# Altium schematic sheet MCU_CTRL.SchDoc: Y1701
size A3; Date: 2018.11.13; Author: Xianrui; CompanyName: 成都捷祥医疗器械有限公司; Revision: V1.0; SheetNumber: 2; SheetTotal: 6
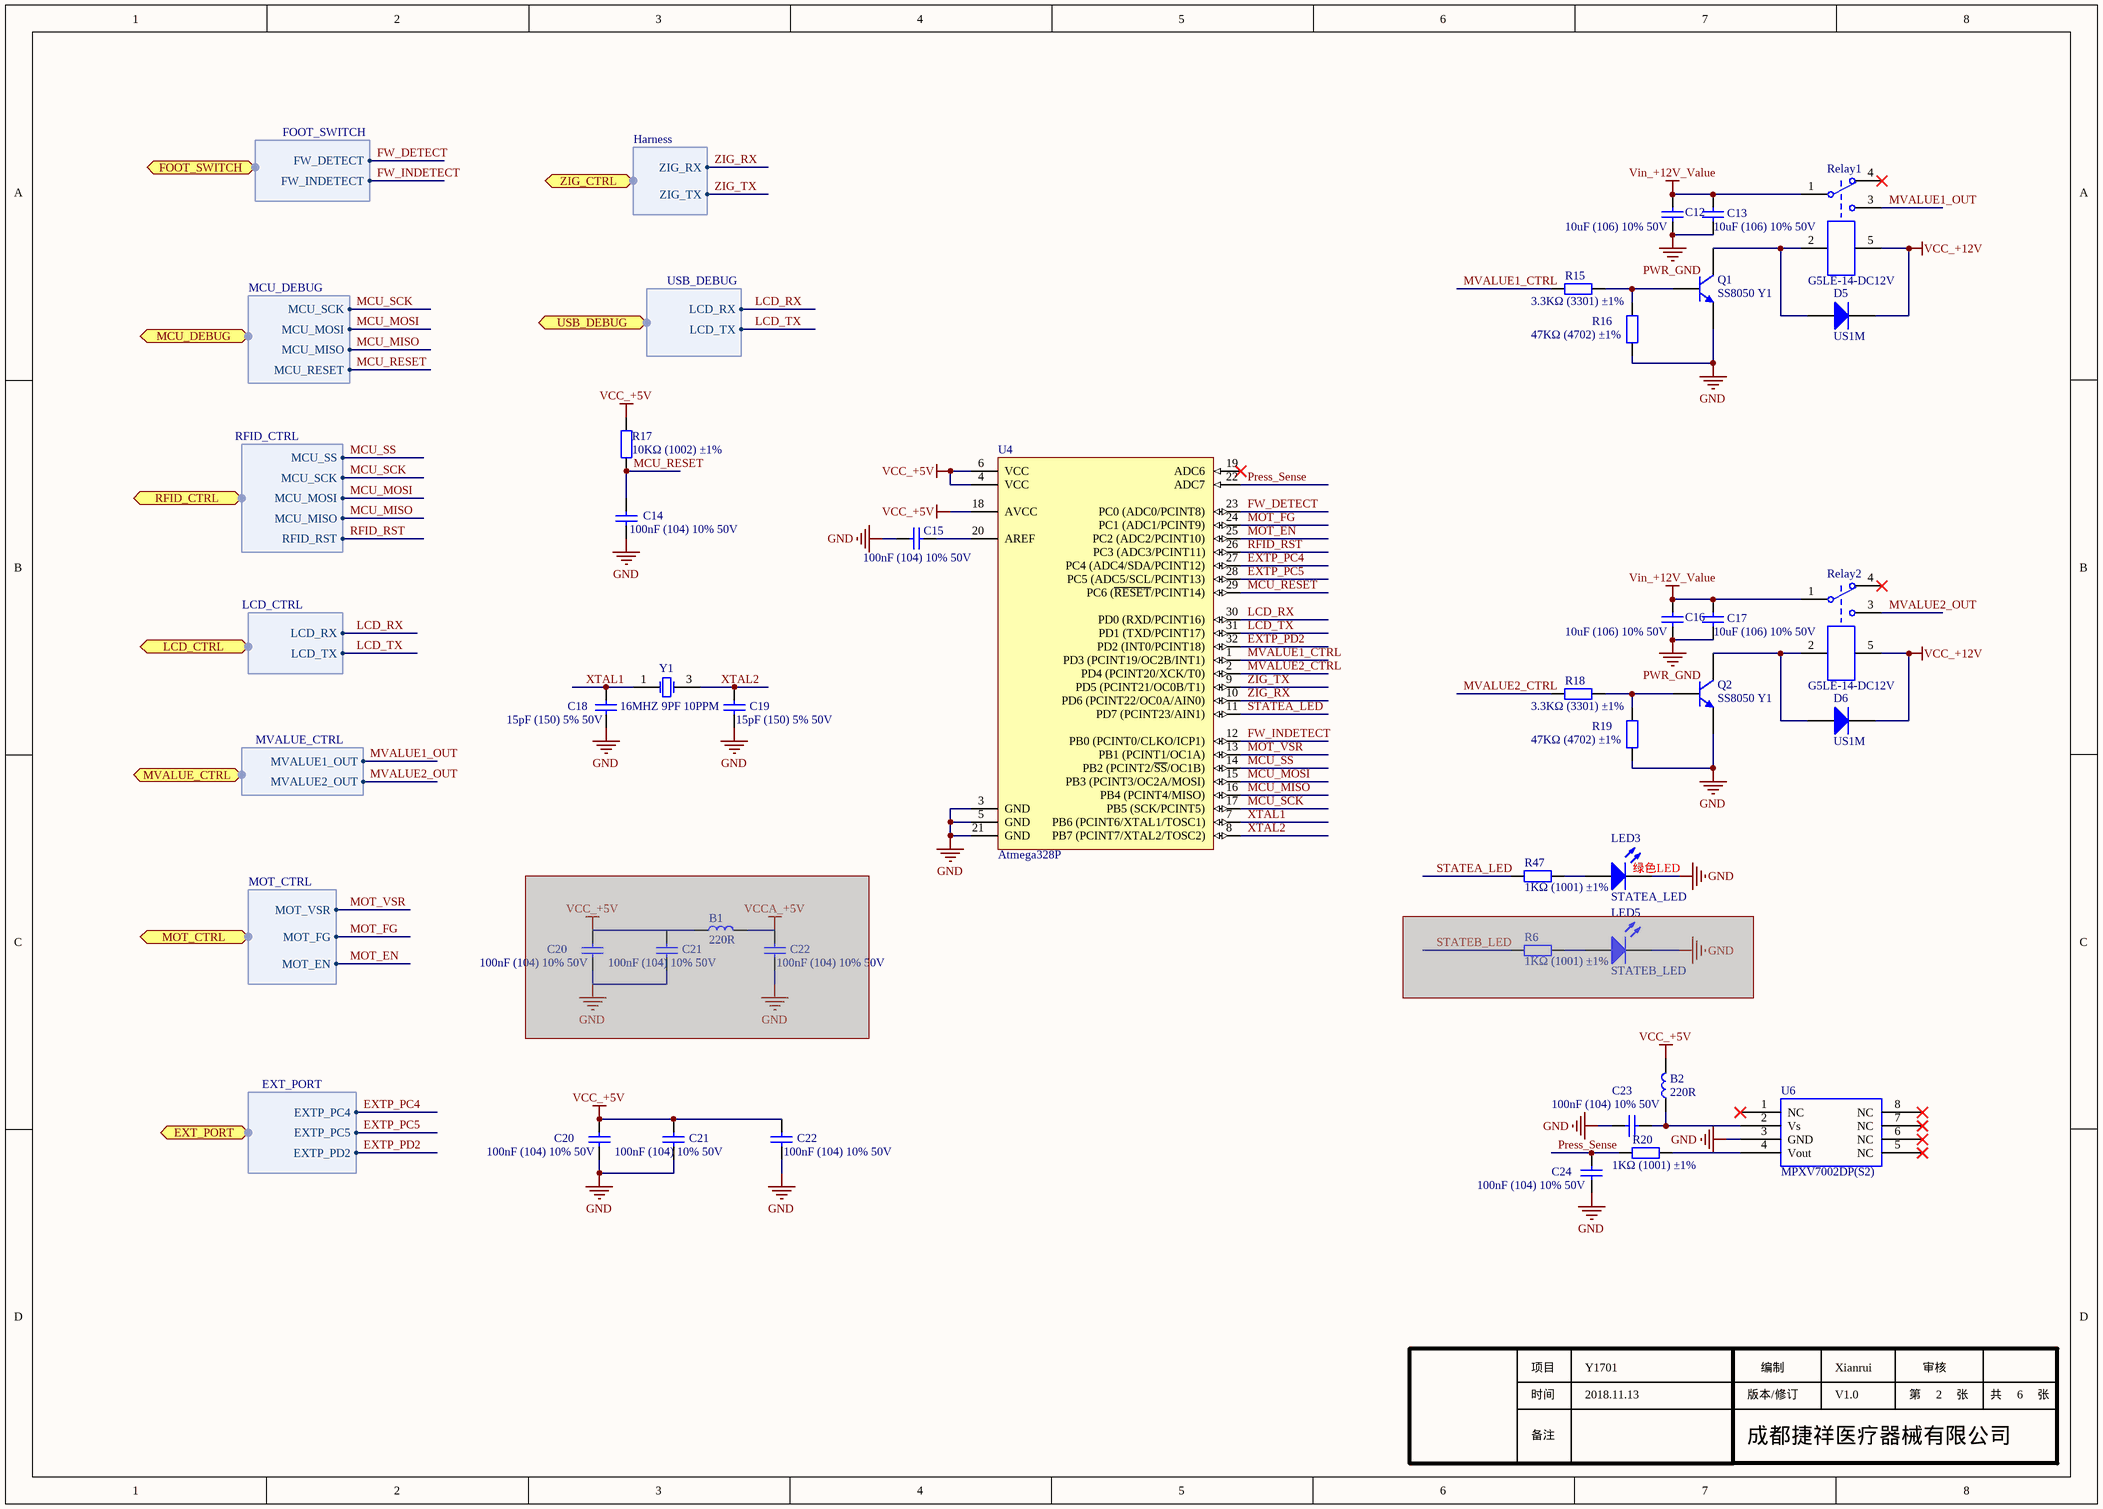
[diagram p0: MCU_CTRL.SchDoc]

## Parts
(Parts that share a designator on the sheet are numbered #1, #2 ... from top to bottom, then left to right.)
B1  220R  [LC-0805_L]  (masked out: inside a compile mask, not in the netlist)
B2  220R  [LC-0805_L]
C12  10uF (106) 10% 50V  [LC-1206_C]
C13  10uF (106) 10% 50V  [LC-1206_C]
C14  100nF (104) 10% 50V  [LC-0603_C]
C15  100nF (104) 10% 50V  [LC-0603_C]
C16  10uF (106) 10% 50V  [LC-1206_C]
C17  10uF (106) 10% 50V  [LC-1206_C]
C18  15pF (150) 5% 50V  [LC-0603_C]
C19  15pF (150) 5% 50V  [LC-0603_C]
C20#1  100nF (104) 10% 50V  [LC-0603_C]  (masked out: inside a compile mask, not in the netlist)
C20#2  100nF (104) 10% 50V  [LC-0603_C]
C21#1  100nF (104) 10% 50V  [LC-0603_C]  (masked out: inside a compile mask, not in the netlist)
C21#2  100nF (104) 10% 50V  [LC-0603_C]
C22#1  100nF (104) 10% 50V  [LC-0603_C]  (masked out: inside a compile mask, not in the netlist)
C22#2  100nF (104) 10% 50V  [LC-0603_C]
C23  100nF (104) 10% 50V  [LC-0603_C]
C24  100nF (104) 10% 50V  [LC-0603_C]
D5  US1M  [LC-SMA(DO-214AC)_S1]
D6  US1M  [LC-SMA(DO-214AC)_S1]
LED3  STATEA_LED  [LC-0603_LED_S1]
LED5  STATEB_LED  [LC-0603_LED_S1]  (masked out: inside a compile mask, not in the netlist)
Q1  SS8050 Y1  [LC-SOT-23(SOT-23-3)]
Q2  SS8050 Y1  [LC-SOT-23(SOT-23-3)]
R6  1KΩ (1001) ±1%  [LC-0603_R]  (masked out: inside a compile mask, not in the netlist)
R15  3.3KΩ (3301) ±1%  [LC-0603_R]
R16  47KΩ (4702) ±1%  [LC-0603_R]
R17  10KΩ (1002) ±1%  [LC-0603_R]
R18  3.3KΩ (3301) ±1%  [LC-0603_R]
R19  47KΩ (4702) ±1%  [LC-0603_R]
R20  1KΩ (1001) ±1%  [LC-0603_R]
R47  1KΩ (1001) ±1%  [LC-0603_R]
Relay1  G5LE-14-DC12V  [RCRELAY-G5LE-14]
Relay2  G5LE-14-DC12V  [RCRELAY-G5LE-14]
U4  Atmega328P  [RCIC-TQFP-32]
U6  MPXV7002DP(S2)  [MPXV7002DP]
Y1  16MHZ 9PF 10PPM  [LC-SMD-3225_4P]

## Ports
EXT_PORT (harness EXT_PORT), FOOT_SWITCH (harness FOOT_SWITCH), LCD_CTRL (harness LCD_CTRL), MCU_DEBUG (harness MCU_DEBUG), MOT_CTRL (harness MOT_CTRL), MVALUE_CTRL (harness MVALUE_CTRL), RFID_CTRL (harness RFID_CTRL), USB_DEBUG (harness USB_DEBUG), ZIG_CTRL (harness Harness)

## Harnesses
RFID_CTRL: MCU_SS, MCU_SCK, MCU_MOSI, MCU_MISO, RFID_RST
MCU_DEBUG: MCU_SCK, MCU_MOSI, MCU_MISO, MCU_RESET
LCD_CTRL: LCD_RX, LCD_TX
MVALUE_CTRL: MVALUE1_OUT, MVALUE2_OUT
EXT_PORT: EXTP_PC4, EXTP_PC5, EXTP_PD2
Harness: ZIG_RX, ZIG_TX
FOOT_SWITCH: FW_DETECT, FW_INDETECT
USB_DEBUG: LCD_RX, LCD_TX
MOT_CTRL: MOT_VSR, MOT_FG, MOT_EN

## Nets
GND: C14.1 C15.1 C18.1 C19.1 C20#2.1 C21#2.1 C22#2.1 C23.2 C24.1 LED3.K Q1.2(E) Q2.2(E) R16.1 R19.1 U4.3(GND) U4.5(GND) U4.21(GND) U6.3(GND)
PWR_GND: C12.1 C13.1 C16.1 C17.1
VCC_+5V: B2.2 C20#2.2 C21#2.2 C22#2.2 R17.2 U4.4(VCC) U4.6(VCC) U4.18(AVCC)
VCC_+12V: D5.2(K) D6.2(K) Relay1.5 Relay2.5
Vin_+12V_Value: C12.2 C13.2 C16.2 C17.2 Relay1.1 Relay2.1
EXTP_PC4: U4.27(PC4_(ADC4/SDA/PCINT12)) ; port EXT_PORT.EXTP_PC4
EXTP_PC5: U4.28(PC5_(ADC5/SCL/PCINT13)) ; port EXT_PORT.EXTP_PC5
EXTP_PD2: U4.32(PD2_(INT0/PCINT18)) ; port EXT_PORT.EXTP_PD2
FW_DETECT: U4.23(PC0_(ADC0/PCINT8)) ; port FOOT_SWITCH.FW_DETECT
FW_INDETECT: U4.12(PB0_(PCINT0/CLKO/ICP1)) ; port FOOT_SWITCH.FW_INDETECT
LCD_RX: U4.30(PD0_(RXD/PCINT16)) ; port LCD_CTRL.LCD_RX, port USB_DEBUG.LCD_RX
LCD_TX: U4.31(PD1_(TXD/PCINT17)) ; port LCD_CTRL.LCD_TX, port USB_DEBUG.LCD_TX
MCU_MISO: U4.16(PB4_(PCINT4/MISO)) ; port RFID_CTRL.MCU_MISO, port MCU_DEBUG.MCU_MISO
MCU_MOSI: U4.15(PB3_(PCINT3/OC2A/MOSI)) ; port RFID_CTRL.MCU_MOSI, port MCU_DEBUG.MCU_MOSI
MCU_RESET: C14.2 R17.1 U4.29(PC6_(~{RESET}/PCINT14)) ; port MCU_DEBUG.MCU_RESET
MCU_SCK: U4.17(PB5_(SCK/PCINT5)) ; port RFID_CTRL.MCU_SCK, port MCU_DEBUG.MCU_SCK
MCU_SS: U4.14(PB2_(PCINT2/~{SS}/OC1B)) ; port RFID_CTRL.MCU_SS
MOT_EN: U4.25(PC2_(ADC2/PCINT10)) ; port MOT_CTRL.MOT_EN
MOT_FG: U4.24(PC1_(ADC1/PCINT9)) ; port MOT_CTRL.MOT_FG
MOT_VSR: U4.13(PB1_(PCINT1/OC1A)) ; port MOT_CTRL.MOT_VSR
MVALUE1_CTRL: R15.1 U4.1(PD3_(PCINT19/OC2B/INT1))
MVALUE1_OUT: Relay1.3 ; port MVALUE_CTRL.MVALUE1_OUT
MVALUE2_CTRL: R18.1 U4.2(PD4_(PCINT20/XCK/T0))
MVALUE2_OUT: Relay2.3 ; port MVALUE_CTRL.MVALUE2_OUT
Press_Sense: C24.2 R20.1 U4.22(ADC7)
RFID_RST: U4.26(PC3_(ADC3/PCINT11)) ; port RFID_CTRL.RFID_RST
STATEA_LED: R47.1 U4.11(PD7_(PCINT23/AIN1))
XTAL1: C18.2 U4.7(PB6_(PCINT6/XTAL1/TOSC1)) Y1.1(OSC1)
XTAL2: C19.2 U4.8(PB7_(PCINT7/XTAL2/TOSC2)) Y1.3(OSC2)
ZIG_RX: U4.10(PD6_(PCINT22/OC0A/AIN0)) ; port ZIG_CTRL.ZIG_RX
ZIG_TX: U4.9(PD5_(PCINT21/OC0B/T1)) ; port ZIG_CTRL.ZIG_TX
NetB2_1: B2.1 C23.1 U6.2(Vs)
NetC15_2: C15.2 U4.20(AREF)
NetD5_1: D5.1(A) Q1.3(C) Relay1.2
NetD6_1: D6.1(A) Q2.3(C) Relay2.2
NetLED3_A: LED3.A R47.2
NetQ1_1: Q1.1(B) R15.2 R16.2
NetQ2_1: Q2.1(B) R18.2 R19.2
NetR20_2: R20.2 U6.4(Vout)

Not connected (* = marked no-connect by the designer): Relay1 4*; Relay2 4*; U4 19(ADC6)*; U6 1(NC)* 5(NC)* 6(NC)* 7(NC)* 8(NC)*

## Notes on the sheet
- (near LED3) 绿色LED
- 项目
- 时间
- 版本/修订
- 编制
- 第
- 审核
- 张
- 共
- 备注

## Library data of the parts
B1 B2 = Bead: Bead,1400mA; Manufacture: muRata(村田); Ordering: BLM21PG221SN1; Comments: 220R; Libnum: *; LC: http://item.szlcsc.com/87016.html; LC Supplier Part Number: C85840
C12 C13 C16 C17 = 1206 10uF (106) 10% 50V: 贴片电容; ComponentLink1Description: 供应商链接; ComponentLink1URL: http://www.szlcsc.com/product/details_14236.html; Package: 1206; Supplier: LC; SuppliersPartNumber: C13585
C14 C15 C20#1 C20#2 C21#1 C21#2 C22#1 C22#2 C23 C24 = 0603 100nF (104) 10% 50V: 贴片电容; ComponentLink1Description: 供应商链接; ComponentLink1URL: http://www.szlcsc.com/product/details_15331.html; Package: 0603; Supplier: LC; SuppliersPartNumber: C14663
C18 C19 = 0603 15pF (150) 5% 50V: 贴片电容; ComponentLink1Description: 供应商链接; ComponentLink1URL: http://www.szlcsc.com/product/details_1996.html; Package: 0603; Supplier: LC; SuppliersPartNumber: C1644
D5 D6 = SMA(DO-214AC) US1M: 二极管; ComponentLink1Description: 供应商链接; ComponentLink1URL: http://www.szlcsc.com/product/details_5885.html; Package: SMA(DO-214AC); Supplier: LC; SuppliersPartNumber: C5441
LED3 LED5 = LEDA: Libnum: *; Manufacture: *; Odering: *
  LED3: Comments: STATEA_LED
  LED5: Comments: STATEB_LED
Q1 Q2 = SOT-23 SS8050 Y1: 三极管; ComponentLink1Description: 供应商链接; ComponentLink1URL: http://www.szlcsc.com/product/details_2507.html; Package: SOT-23; Supplier: LC; SuppliersPartNumber: C2150
R6 R20 R47 = 0603 1KΩ (1001) 1%: 贴片电阻; ComponentLink1Description: 供应商链接; ComponentLink1URL: http://www.szlcsc.com/product/details_21904.html; Package: 0603; Supplier: LC; SuppliersPartNumber: C21190
R15 R18 = 0603 3.3KΩ (3301) 1%: 贴片电阻; ComponentLink1Description: 供应商链接; ComponentLink1URL: http://www.szlcsc.com/product/details_23705.html; Package: 0603; Supplier: LC; SuppliersPartNumber: C22978
R16 R19 = 0603 47KΩ (4702) 1%: 贴片电阻; ComponentLink1Description: 供应商链接; ComponentLink1URL: http://www.szlcsc.com/product/details_26562.html; Package: 0603; Supplier: LC; SuppliersPartNumber: C25819
R17 = 0603 10KΩ (1002) 1%: 贴片电阻; ComponentLink1Description: 供应商链接; ComponentLink1URL: http://www.szlcsc.com/product/details_26547.html; Package: 0603; Supplier: LC; SuppliersPartNumber: C25804
Relay1 Relay2 = G5LE: Relay; Manufacture: Ormon; Comments: G5LE-14-DC12V; Libnum: *; Ordering: G5LE-14-DC12V
U4 = Atmega328P: Atmel 8-bit Microcontroller; Ordering: Atmega328P-AU; Comments: Atmega328P; Libnum: *; Manufacture: Atmel
U6 = MPXV7002(Style2): Integrated Silicon Pressure Sensor; Manufacture: Freescale; Comments: MPXV7002DP(S2); Libnum: *; Ordering: MPXV7002DP
Y1 = SMD-3225_4P  16MHZ 9PF 10PPM: 贴片晶振; ComponentLink1Description: 供应商链接; ComponentLink1URL: http://www.szlcsc.com/product/details_14393.html; Package: SMD-3225_4P; Supplier: LC; SuppliersPartNumber: C13738